# EAGLE schematic teszt (EAGLE 6.5.0)
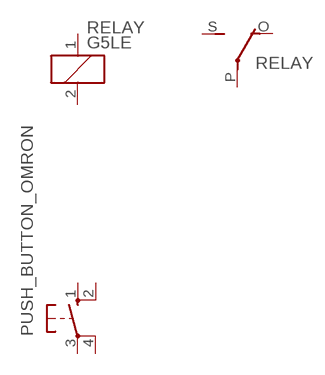
[diagram p0: schematic, sheet 1]

## Parts
PUSH_BUTTON_OMRON  10-XX  [B3F-10XX]
RELAY  G5LE  [G5LE]
Unconnected: PUSH_BUTTON_OMRON.1(S) PUSH_BUTTON_OMRON.2(S1) PUSH_BUTTON_OMRON.3(P) PUSH_BUTTON_OMRON.4(P1) RELAY.1 RELAY.2 RELAY.O(2:O) RELAY.P(2:P) RELAY.S(2:S)

## Library data of the parts
PUSH_BUTTON_OMRON = switch-omron:10-XX: OMRON SWITCH; MPN: B3F-1000; OC_FARNELL: 176432; OC_NEWARK: 36M3542
RELAY = relay:G5LE: RELAY 1 x switch, 10 A/120 V AC, 8 A/30 V DC, Omron; OC_FARNELL: unknown; OC_NEWARK: unknown